# Altium schematic sheet PIC32MK.SchDoc
size B; DocumentNumber: 5; SheetNumber: 4; SheetTotal: 7
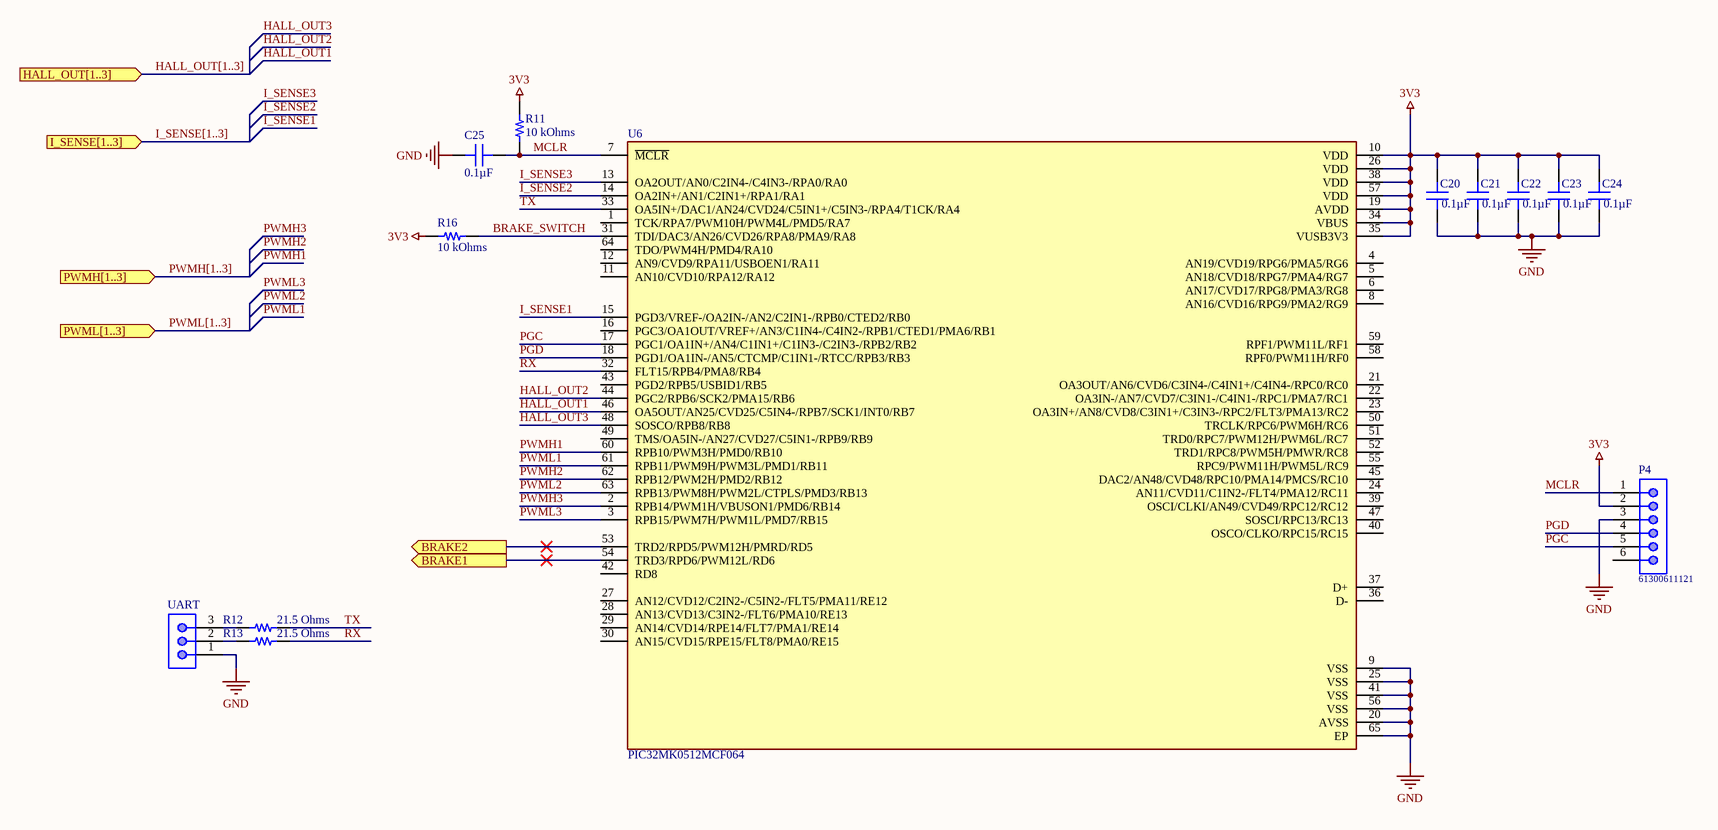
[diagram p0: PIC32MK.SchDoc]

## Parts
C20  0.1µF  [CAP 0603_1608]
C21  0.1µF  [CAP 0603_1608]
C22  0.1µF  [CAP 0603_1608]
C23  0.1µF  [CAP 0603_1608]
C24  0.1µF  [CAP 0603_1608]
C25  0.1µF  [CAP 0603_1608]
P4  61300611121  [61300611121]
R11  10 kOhms  [RES 0603_1608]
R12  21.5 Ohms  [RES 0603_1608]
R13  21.5 Ohms  [RES 0603_1608]
R16  10 kOhms  [RES 0603_1608]
U6  PIC32MK0512MCF064  [QFN50P900X900X100-65N]
UART  3 pin 2mm JST Male  [3pin - 2mm header]  (value not drawn)

## Ports
BRAKE1 (out), BRAKE2 (out), HALL_OUT[1..3] (in), I_SENSE[1..3] (in), PWMH[1..3] (in), PWML[1..3] (in)

## Nets
3V3: C20.1 C21.1 C22.1 C23.1 C24.1 P4.2 R11.2 R16.2 U6.10(VDD) U6.19(AVDD) U6.26(VDD) U6.34(VBUS) U6.35(VUSB3V3) U6.38(VDD) U6.57(VDD)
GND: C20.2 C21.2 C22.2 C23.2 C24.2 C25.2 P4.3 U6.9(VSS) U6.20(AVSS) U6.25(VSS) U6.41(VSS) U6.56(VSS) U6.65(EP) UART.1
BRAKE1: U6.54(TRD3/RPD6/PWM12L/RD6) ; port BRAKE1
BRAKE2: U6.53(TRD2/RPD5/PWM12H/PMRD/RD5) ; port BRAKE2
BRAKE_SWITCH: R16.1 U6.31(TDI/DAC3/AN26/CVD26/RPA8/PMA9/RA8)
HALL_OUT1: U6.46(OA5OUT/AN25/CVD25/C5IN4-/RPB7/SCK1/INT0/RB7)
HALL_OUT2: U6.44(PGC2/RPB6/SCK2/PMA15/RB6)
HALL_OUT3: U6.48(SOSCO/RPB8/RB8)
I_SENSE1: U6.15(PGD3/VREF-/OA2IN-/AN2/C2IN1-/RPB0/CTED2/RB0)
I_SENSE2: U6.14(OA2IN+/AN1/C2IN1+/RPA1/RA1)
I_SENSE3: U6.13(OA2OUT/AN0/C2IN4-/C4IN3-/RPA0/RA0)
MCLR: C25.1 P4.1 R11.1 U6.7(~{MCLR})
PGC: P4.5 U6.17(PGC1/OA1IN+/AN4/C1IN1+/C1IN3-/C2IN3-/RPB2/RB2)
PGD: P4.4 U6.18(PGD1/OA1IN-/AN5/CTCMP/C1IN1-/RTCC/RPB3/RB3)
PWMH1: U6.60(RPB10/PWM3H/PMD0/RB10)
PWMH2: U6.62(RPB12/PWM2H/PMD2/RB12)
PWMH3: U6.2(RPB14/PWM1H/VBUSON1/PMD6/RB14)
PWML1: U6.61(RPB11/PWM9H/PWM3L/PMD1/RB11)
PWML2: U6.63(RPB13/PWM8H/PWM2L/CTPLS/PMD3/RB13)
PWML3: U6.3(RPB15/PWM7H/PWM1L/PMD7/RB15)
RX: R13.2 U6.32(FLT15/RPB4/PMA8/RB4)
TX: R12.2 U6.33(OA5IN+/DAC1/AN24/CVD24/C5IN1+/C5IN3-/RPA4/T1CK/RA4)
NetR12_1: R12.1 UART.3
NetR13_1: R13.1 UART.2

Not connected (* = marked no-connect by the designer): P4 6; U6 1(TCK/RPA7/PWM10H/PWM4L/PMD5/RA7) 4(AN19/CVD19/RPG6/PMA5/RG6) 5(AN18/CVD18/RPG7/PMA4/RG7) 6(AN17/CVD17/RPG8/PMA3/RG8) 8(AN16/CVD16/RPG9/PMA2/RG9) 11(AN10/CVD10/RPA12/RA12) 12(AN9/CVD9/RPA11/USBOEN1/RA11) 16(PGC3/OA1OUT/VREF+/AN3/C1IN4-/C4IN2-/RPB1/CTED1/PMA6/RB1) 21(OA3OUT/AN6/CVD6/C3IN4-/C4IN1+/C4IN4-/RPC0/RC0) 22(OA3IN-/AN7/CVD7/C3IN1-/C4IN1-/RPC1/PMA7/RC1) 23(OA3IN+/AN8/CVD8/C3IN1+/C3IN3-/RPC2/FLT3/PMA13/RC2) 24(AN11/CVD11/C1IN2-/FLT4/PMA12/RC11) 27(AN12/CVD12/C2IN2-/C5IN2-/FLT5/PMA11/RE12) 28(AN13/CVD13/C3IN2-/FLT6/PMA10/RE13) 29(AN14/CVD14/RPE14/FLT7/PMA1/RE14) 30(AN15/CVD15/RPE15/FLT8/PMA0/RE15) 36(D-) 37(D+) 39(OSCI/CLKI/AN49/CVD49/RPC12/RC12) 40(OSCO/CLKO/RPC15/RC15) 42(RD8) 43(PGD2/RPB5/USBID1/RB5) 45(DAC2/AN48/CVD48/RPC10/PMA14/PMCS/RC10) 47(SOSCI/RPC13/RC13) 49(TMS/OA5IN-/AN27/CVD27/C5IN1-/RPB9/RB9) 50(TRCLK/RPC6/PWM6H/RC6) 51(TRD0/RPC7/PWM12H/PWM6L/RC7) 52(TRD1/RPC8/PWM5H/PMWR/RC8) 55(RPC9/PWM11H/PWM5L/RC9) 58(RPF0/PWM11H/RF0) 59(RPF1/PWM11L/RF1) 64(TDO/PWM4H/PMD4/RA10)

## Buses and harness runs
bus HALL_OUT[1..3] = port HALL_OUT[1..3]
bus I_SENSE[1..3] = port I_SENSE[1..3]
bus PWMH[1..3] = port PWMH[1..3]
bus PWML[1..3] = port PWML[1..3]

## Library data of the parts
C20-C25 = GCG188R92A104KA03D: CAP CER 0.1UF 100V 0603 EPOXY; Manufacturer: Murata Electronics; Temperature Coefficient: X8R; Tolerance: ±10%; Part Number: GCG188R92A104KA03D; Value: 0.1µF; Applications: Automotive; Capacitance: 0.1µF; ComponentLink1Description: Datasheet; ComponentLink1URL: https://search.murata.co.jp/Ceramy/image/img/A01X/G101/ENG/GCG188R92A104KA03-01.pdf; ComponentLink2Description: DigiKey Link; ComponentLink2URL: http://digikey.com/product-detail/en/murata-electronics/GCG188R92A104KA03D/490-18197-1-ND/9867926; Device Package: 0603 (1608 Metric); Features: Epoxy Mountable; LastUpdated: 21-Jan-20 12:01:59 AM; Lifecycle Status: Active; Minimum Order: 1; Mounting Type: Surface Mount, MLCC, Epoxy; Operating Temperature: -55°C ~ 150°C; Package / Case: 0603 (1608 Metric); Packaging: TapeAndReel; PartId: 9025; Part Status: Active; Price: 0.07; Ratings: AEC-Q200; Series: GCG; Size / Dimension: 0.063" L x 0.031" W (1.60mm x 0.80mm); Supplier 1: DigiKey; Supplier Part Number 1: 490-18197-1-ND; Thickness (Max): 0.035" (0.90mm); Voltage - Rated: 100V
P4 = 61300611121: WR-PHD Pin Header, THT, pitch 2.54mm, Single Row, Vertical, 6p; Manufacturer: Wurth Elektronik; Pin Number: 6; Rated Current: 3A; Working Voltage: 250VAC; Withstanding Voltage: 500VAC; Contact Resistance: 20mOhm; ComponentLink1Description: Manufacturer; ComponentLink1URL: http://www.we-online.de; ComponentLink2Description: Datasheet; ComponentLink2URL: https://www.we-online.com/catalog/datasheet/61300611121.pdf; Manufacturer Part Number: 61300611121; Published Date: May 2020; Pitch: 2.54mm; Operating Temperature: -40 to +105degC; Mounting Technology: THT; Packaging: Bag; Gender: Pin Header; Row Number: Single; Orientation: Vertical
R11 R16 = RNCS0603BKE10K0: RES 10K OHM 0.1% 1/16W 0603; Manufacturer: Stackpole Electronics Inc; Power (Watts): 0.063W, 1/16W; Temperature Coefficient: ±25ppm/°C; Part Number: RNCS0603BKE10K0; Value: 10 kOhms; ComponentLink1Description: Datasheet; ComponentLink1URL: https://www.seielect.com/catalog/sei-rncs_rnch.pdf; ComponentLink2Description: DigiKey Link; ComponentLink2URL: http://digikey.com/product-detail/en/stackpole-electronics-inc/RNCS0603BKE10K0/RNCS0603BKE10K0CT-ND/1800113; Composition: Thin Film; Device Package: 0603 (1608 Metric); Features: Anti-Corrosive, Automotive AEC-Q200, Moisture Resistant; Height - Seated (Max): 0.022" (0.55mm); LastUpdated: 21-Jan-20 12:25:01 AM; Lifecycle Status: Active; Minimum Order: 1; Number of Terminations: 2; Operating Temperature: -55°C ~ 155°C; Package / Case: 0603 (1608 Metric); Packaging: TapeAndReel; PartId: 4838; Part Status: Active; Price: 0.08; Ratings: AEC-Q200; Resistance: 10 kOhms; Series: RNCS; Size / Dimension: 0.061" L x 0.031" W (1.55mm x 0.80mm); Supplier 1: DigiKey; Supplier Part Number 1: RNCS0603BKE10K0CT-ND; Supplier Device Package: 0603; Tolerance: ±0.1%
R12 R13 = ERJ-3EKF21R5V: RES SMD 21.5 OHM 1% 1/10W 0603; Manufacturer: Panasonic Electronic Components; Power (Watts): 0.1W, 1/10W; Temperature Coefficient: ±100ppm/°C; Part Number: ERJ-3EKF21R5V; Value: 21.5 Ohms; ComponentLink1Description: Datasheet; ComponentLink1URL: https://industrial.panasonic.com/cdbs/www-data/pdf/RDA0000/AOA0000C304.pdf; ComponentLink2Description: DigiKey Link; ComponentLink2URL: http://digikey.com/product-detail/en/panasonic-electronic-components/ERJ-3EKF21R5V/P21.5HCT-ND/198246; Composition: Thick Film; Device Package: 0603 (1608 Metric); Features: Automotive AEC-Q200; Height - Seated (Max): 0.022" (0.55mm); LastUpdated: 21-Jan-20 12:16:19 AM; Lifecycle Status: Active; Minimum Order: 1; Number of Terminations: 2; Operating Temperature: -55°C ~ 155°C; Package / Case: 0603 (1608 Metric); Packaging: TapeAndReel; PartId: 24202; Part Status: Active; Price: 0.01; Ratings: AEC-Q200; Resistance: 21.5 Ohms; Series: ERJ; Size / Dimension: 0.063" L x 0.031" W (1.60mm x 0.80mm); Supplier 1: DigiKey; Supplier Part Number 1: P21.5HCT-ND; Supplier Device Package: 0603; Tolerance: ±1%
U6 = PIC32MK0512MCF064: PIC32MK Microcontroller IC 32-Bit 120MHz 1MB _1M x 8_ FLASH 64-TQFP _10x10_; MP: PIC32MK1024MCF064-I/PT; MF: Microchip; Digi-Key_Purchase_URL: https://www.digikey.kr/product-detail/en/microchip-technology/PIC32MK1024MCF064-I-PT/PIC32MK1024MCF064-I-PT-ND/7164902?utm_source=snapeda&utm_medium=aggregator&utm_campaign=symbol; Package: TQFP-64 Microchip; Digi-Key_Part_Number: PIC32MK1024MCF064-I/PT-ND; Value: *; SnapEDA_Link: https://www.snapeda.com/parts/PIC32MK1024MCF064-I/PT/Microchip/view-part/876704/?ref=snap